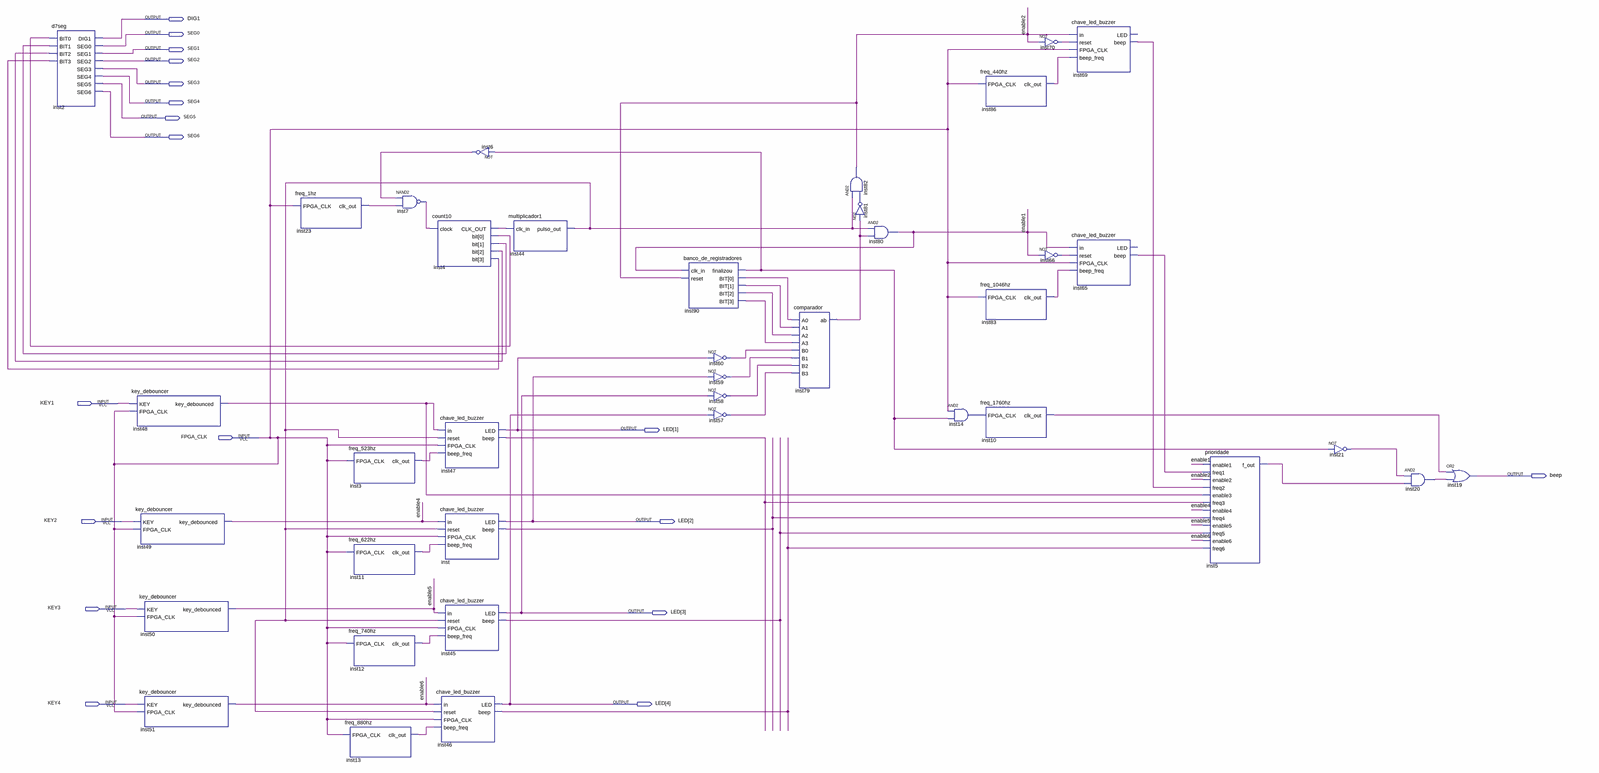
[diagram p0: schematic sheet, whole]
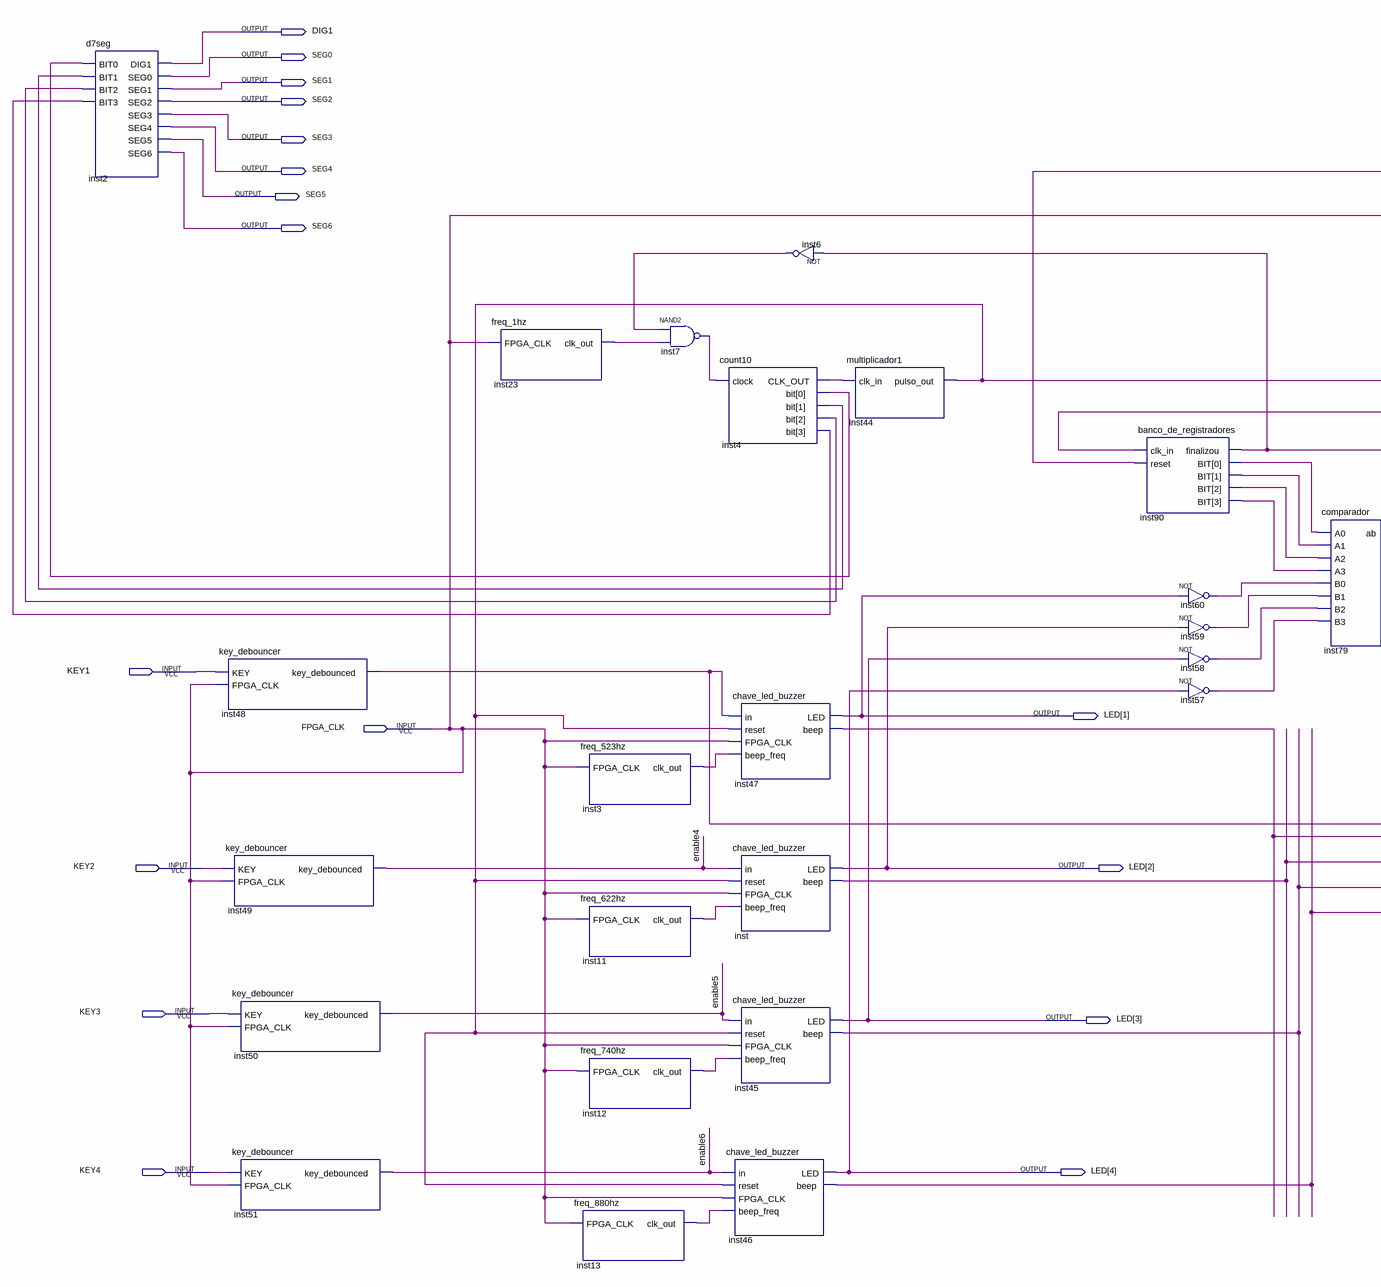
[diagram p1: schematic sheet, left part]
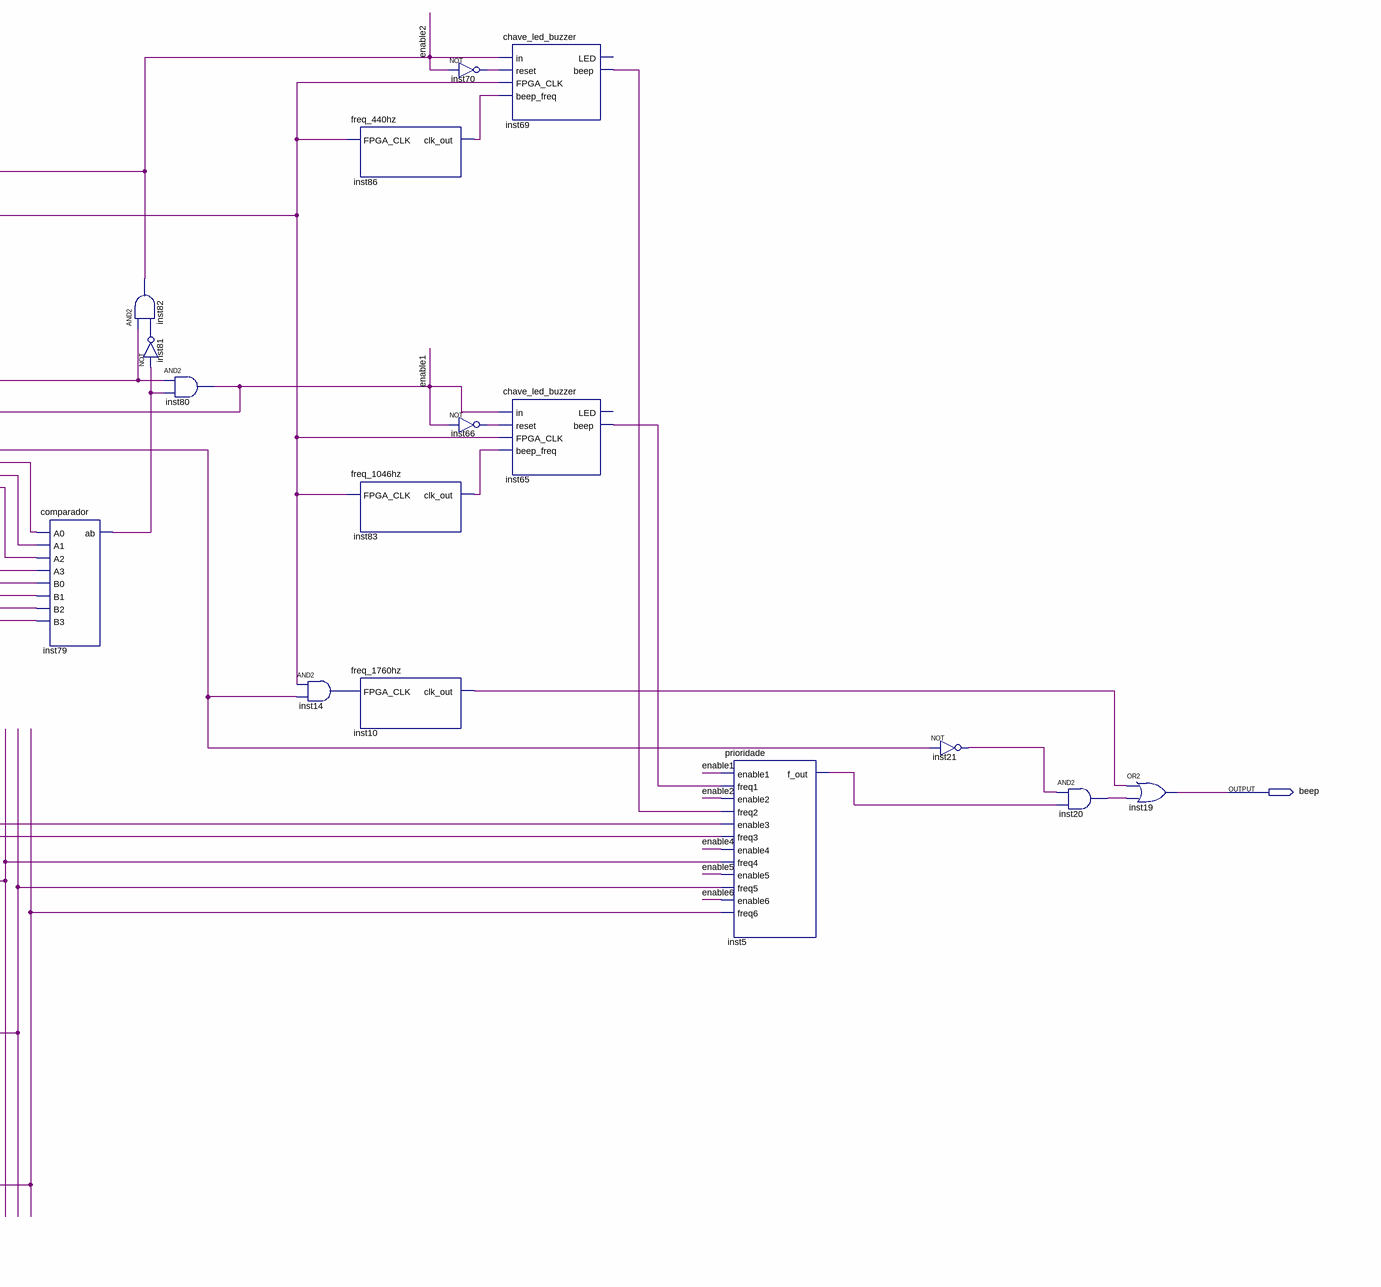
[diagram p2: schematic sheet, right part]
// Quartus schematic projeto1.bdf as structural Verilog: 39 symbols, 18 pins
module projeto1 (
  input  KEY1,
  input  FPGA_CLK,
  input  KEY2,
  input  KEY3,
  input  KEY4,
  output DIG1,
  output SEG0,
  output SEG1,
  output SEG2,
  output SEG3,
  output SEG4,
  output SEG5,
  output SEG6,
  output [4:1] LED,
  output beep
);

  wire enable1, enable2, enable4, enable5, enable6, inst3_clk_out, inst4_bit, inst4_bit_2, inst4_bit_3,
       inst4_bit_4, inst4_clk_out, inst5_f_out, inst6_out, inst7_out, inst10_clk_out, inst11_clk_out,
       inst12_clk_out, inst13_clk_out, inst14_out, inst20_out, inst21_out, inst23_clk_out, inst44_pulso_out,
       inst45_beep, inst46_beep, inst47_beep, inst48_key_debounced, inst57_out, inst58_out, inst59_out,
       inst60_out, inst65_beep, inst66_out, inst69_beep, inst70_out, inst79_ab, inst81_out, inst83_clk_out,
       inst86_clk_out, inst90_bit, inst90_bit_2, inst90_bit_3, inst90_bit_4, inst90_finalizou, inst_beep;

  d7seg inst2 (
    .BIT0(inst4_bit), .BIT1(inst4_bit_2), .BIT2(inst4_bit_3), .BIT3(inst4_bit_4), .DIG1(DIG1), .SEG0(SEG0),
    .SEG1(SEG1), .SEG2(SEG2), .SEG3(SEG3), .SEG4(SEG4), .SEG5(SEG5), .SEG6(SEG6));
  key_debouncer inst48 (.KEY(KEY1), .FPGA_CLK(FPGA_CLK), .key_debounced(inst48_key_debounced));
  key_debouncer inst49 (.KEY(KEY2), .FPGA_CLK(FPGA_CLK), .key_debounced(enable4));
  key_debouncer inst50 (.KEY(KEY3), .FPGA_CLK(FPGA_CLK), .key_debounced(enable5));
  key_debouncer inst51 (.KEY(KEY4), .FPGA_CLK(FPGA_CLK), .key_debounced(enable6));
  freq_1hz inst23 (.FPGA_CLK(FPGA_CLK), .clk_out(inst23_clk_out));
  freq_523hz inst3 (.FPGA_CLK(FPGA_CLK), .clk_out(inst3_clk_out));
  freq_622hz inst11 (.FPGA_CLK(FPGA_CLK), .clk_out(inst11_clk_out));
  freq_740hz inst12 (.FPGA_CLK(FPGA_CLK), .clk_out(inst12_clk_out));
  freq_880hz inst13 (.FPGA_CLK(FPGA_CLK), .clk_out(inst13_clk_out));
  nand inst7 (inst7_out, inst6_out, inst23_clk_out);
  count10 inst4 (
    .clock(inst7_out), .CLK_OUT(inst4_clk_out), .\bit ({inst4_bit_4, inst4_bit_3, inst4_bit_2, inst4_bit}));
  chave_led_buzzer inst47 (
    .in(inst48_key_debounced), .reset(inst44_pulso_out), .FPGA_CLK(FPGA_CLK), .beep_freq(inst3_clk_out),
    .LED(LED[1]), .beep(inst47_beep));
  chave_led_buzzer inst (
    .in(enable4), .reset(inst44_pulso_out), .FPGA_CLK(FPGA_CLK), .beep_freq(inst11_clk_out), .LED(LED[2]),
    .beep(inst_beep));
  chave_led_buzzer inst45 (
    .in(enable5), .reset(inst44_pulso_out), .FPGA_CLK(FPGA_CLK), .beep_freq(inst12_clk_out), .LED(LED[3]),
    .beep(inst45_beep));
  chave_led_buzzer inst46 (
    .in(enable6), .reset(inst44_pulso_out), .FPGA_CLK(FPGA_CLK), .beep_freq(inst13_clk_out), .LED(LED[4]),
    .beep(inst46_beep));
  not inst6 (inst6_out, inst90_finalizou);
  multiplicador1 inst44 (.clk_in(inst4_clk_out), .pulso_out(inst44_pulso_out));
  banco_de_registradores inst90 (
    .clk_in(enable1), .reset(enable2), .finalizou(inst90_finalizou),
    .BIT({inst90_bit_4, inst90_bit_3, inst90_bit_2, inst90_bit}));
  not inst60 (inst60_out, LED[1]);
  not inst59 (inst59_out, LED[2]);
  not inst58 (inst58_out, LED[3]);
  not inst57 (inst57_out, LED[4]);
  comparador inst79 (
    .A0(inst90_bit), .A1(inst90_bit_2), .A2(inst90_bit_3), .A3(inst90_bit_4), .B0(inst60_out),
    .B1(inst59_out), .B2(inst58_out), .B3(inst57_out), .ab(inst79_ab));
  and inst82 (enable2, inst44_pulso_out, inst81_out);
  not inst81 (inst81_out, inst79_ab);
  and inst80 (enable1, inst44_pulso_out, inst79_ab);
  and inst14 (inst14_out, FPGA_CLK, inst90_finalizou);
  freq_440hz inst86 (.FPGA_CLK(FPGA_CLK), .clk_out(inst86_clk_out));
  freq_1046hz inst83 (.FPGA_CLK(FPGA_CLK), .clk_out(inst83_clk_out));
  freq_1760hz inst10 (.FPGA_CLK(inst14_out), .clk_out(inst10_clk_out));
  not inst70 (inst70_out, enable2);
  not inst66 (inst66_out, enable1);
  chave_led_buzzer inst69 (
    .in(enable2), .reset(inst70_out), .FPGA_CLK(FPGA_CLK), .beep_freq(inst86_clk_out), .beep(inst69_beep));  // open: LED
  chave_led_buzzer inst65 (
    .in(enable1), .reset(inst66_out), .FPGA_CLK(FPGA_CLK), .beep_freq(inst83_clk_out), .beep(inst65_beep));  // open: LED
  prioridade inst5 (
    .enable1(enable1), .freq1(inst65_beep), .enable2(enable2), .freq2(inst69_beep),
    .enable3(inst48_key_debounced), .freq3(inst47_beep), .enable4(enable4), .freq4(inst_beep),
    .enable5(enable5), .freq5(inst45_beep), .enable6(enable6), .freq6(inst46_beep), .f_out(inst5_f_out));
  not inst21 (inst21_out, inst90_finalizou);
  and inst20 (inst20_out, inst21_out, inst5_f_out);
  or inst19 (beep, inst10_clk_out, inst20_out);
endmodule
